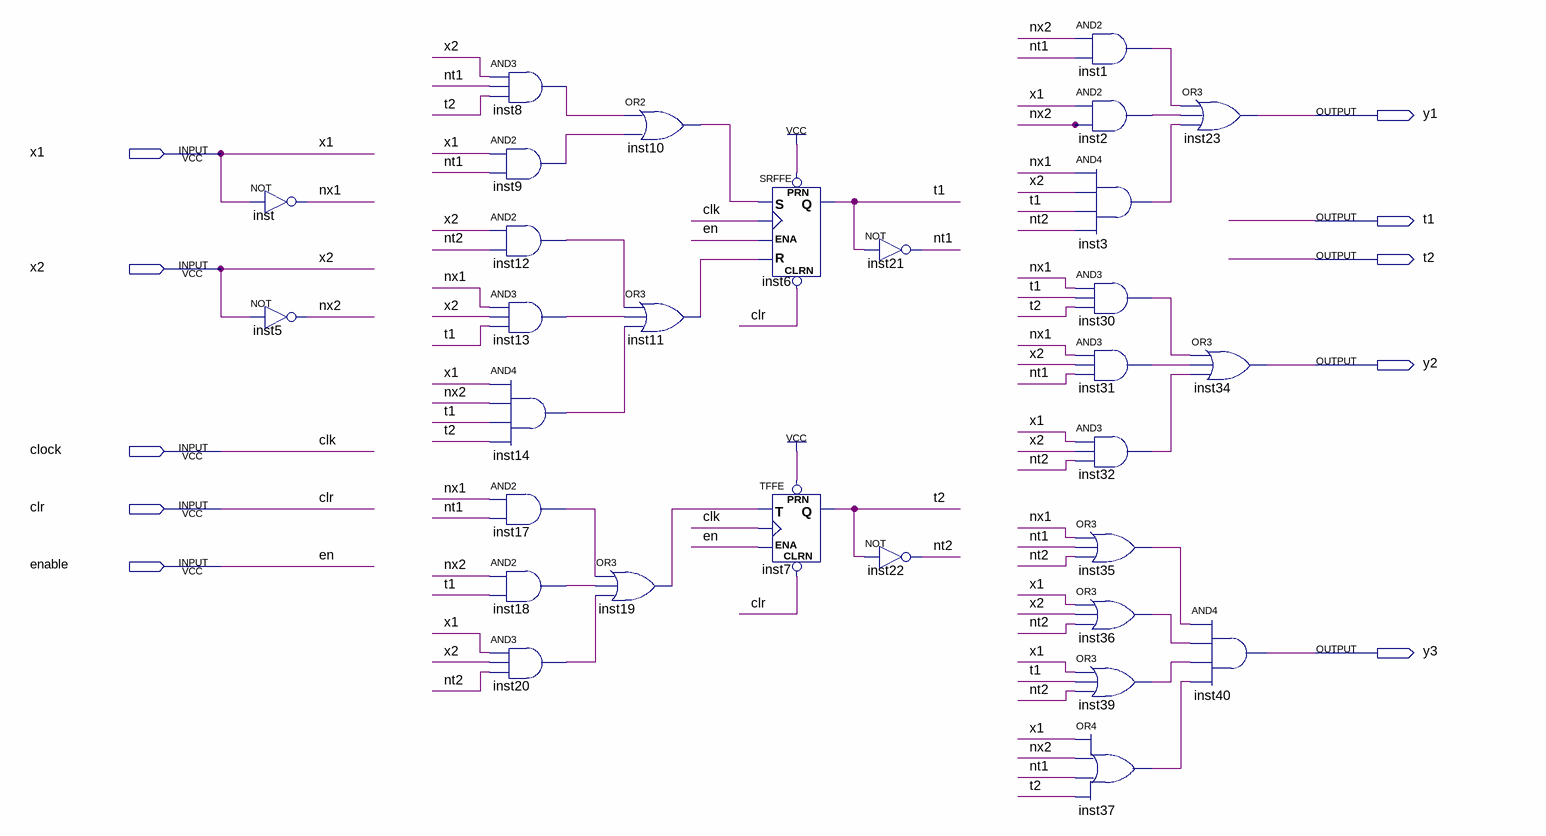
[diagram p0: schematic sheet]
// Quartus schematic struct_mili.bdf as structural Verilog: 30 symbols, 10 pins
module struct_mili (
  input  x1,
  input  x2,
  input  clock,
  input  clr,
  input  enable,
  output y1,
  output t1,
  output t2,
  output y2,
  output y3
);

  wire inst1_out, inst2_out, inst3_out, inst8_out, inst9_out, inst10_out, inst11_out, inst12_out, inst13_out,
       inst14_out, inst17_out, inst18_out, inst19_out, inst20_out, inst30_out, inst31_out, inst32_out,
       inst35_out, inst36_out, inst37_out, inst39_out, nt1, nt2, nx1, nx2;

  not inst (nx1, x1);
  not inst5 (nx2, x2);
  and inst8 (inst8_out, x2, nt1, t2);
  and inst9 (inst9_out, x1, nt1);
  and inst12 (inst12_out, x2, nt2);
  and inst13 (inst13_out, nx1, x2, t1);
  and inst14 (inst14_out, x1, nx2, t1, t2);
  and inst17 (inst17_out, nx1, nt1);
  and inst18 (inst18_out, nx2, t1);
  and inst20 (inst20_out, x1, x2, nt2);
  or inst10 (inst10_out, inst8_out, inst9_out);
  or inst11 (inst11_out, inst12_out, inst13_out, inst14_out);
  or inst19 (inst19_out, inst17_out, inst18_out, inst20_out);
  SRFFE inst6 (.PRN(1'b1), .S(inst10_out), .CLK(clock), .CLRN(clr), .R(inst11_out), .ENA(enable), .Q(t1));
  TFFE inst7 (.CLRN(clr), .T(inst19_out), .CLK(clock), .ENA(enable), .PRN(1'b1), .Q(t2));
  not inst21 (nt1, t1);
  not inst22 (nt2, t2);
  and inst1 (inst1_out, nx2, nt1);
  and inst2 (inst2_out, x1, nx2);
  and inst3 (inst3_out, nx1, x2, t1, nt2);
  and inst30 (inst30_out, nx1, t1, t2);
  and inst31 (inst31_out, nx1, x2, nt1);
  and inst32 (inst32_out, x1, x2, nt2);
  or inst35 (inst35_out, nx1, nt1, nt2);
  or inst36 (inst36_out, x1, x2, nt2);
  or inst39 (inst39_out, x1, t1, nt2);
  or inst37 (inst37_out, x1, nx2, nt1, t2);
  or inst23 (y1, inst1_out, inst2_out, inst3_out);
  or inst34 (y2, inst30_out, inst31_out, inst32_out);
  and inst40 (y3, inst35_out, inst36_out, inst39_out, inst37_out);

  // Other names for the same wires on the sheet: clk = clock; en = enable
endmodule
